# EAGLE design PSU (EAGLE 6.6.0)
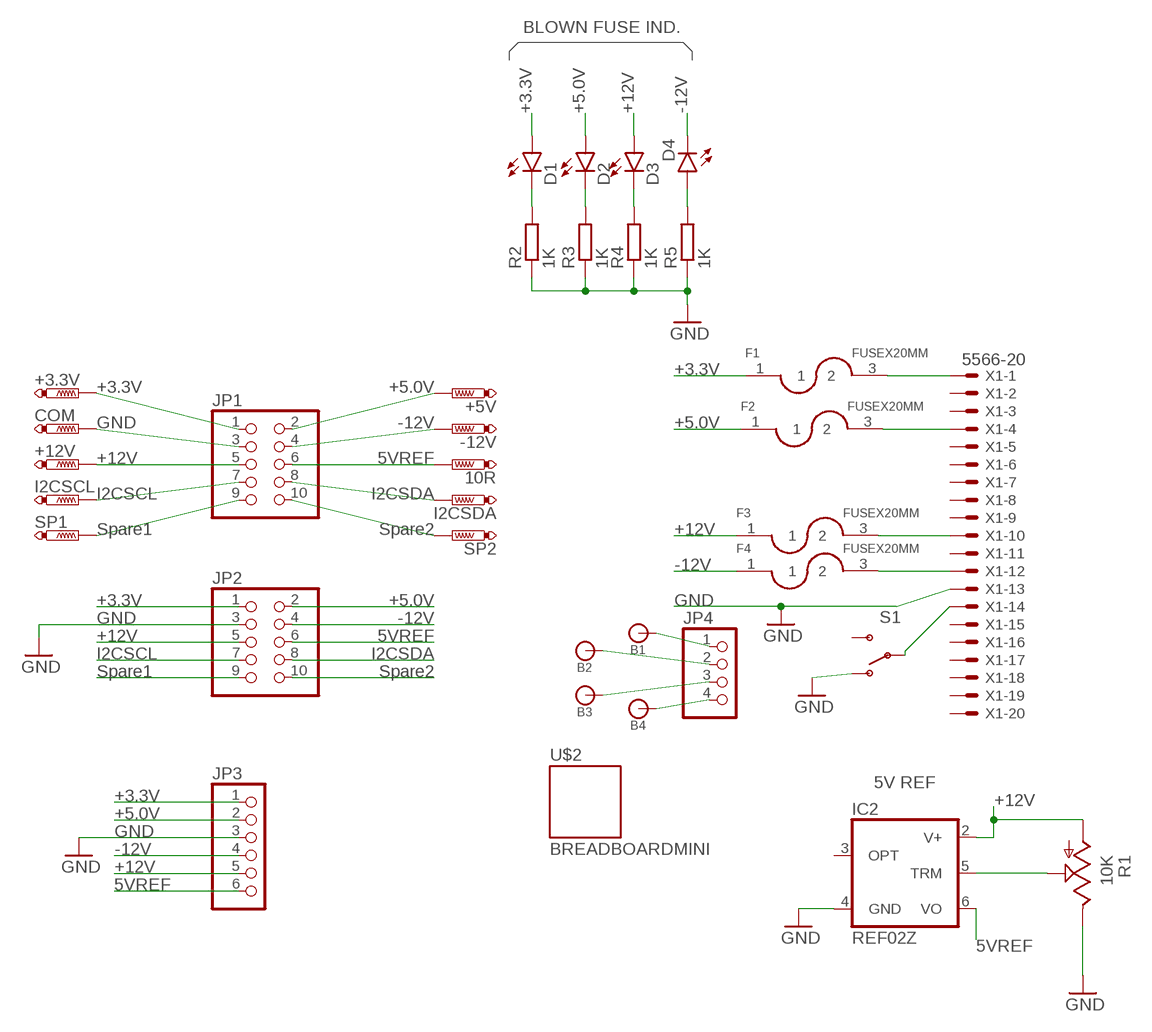
[diagram p0: schematic, sheet 1]

## Parts
10R  PTR1B1,27  [B1,27]
+3.3V  PTR1B1,27  [B1,27]
+5V  PTR1B1,27  [B1,27]
+12V  PTR1B1,27  [B1,27]
-12V  PTR1B1,27  [B1,27]
B1  BANANA_CONN  [BANANA_CONN]
B2  BANANA_CONN  [BANANA_CONN]
B3  BANANA_CONN  [BANANA_CONN]
B4  BANANA_CONN  [BANANA_CONN]
COM  PTR1B1,27  [B1,27]
D1  LED5MM  [LED5MM]
D2  LED5MM  [LED5MM]
D3  LED5MM  [LED5MM]
D4  LED5MM  [LED5MM]
F1  FUSEX20MM  [FUSE_5MM]
F2  FUSEX20MM  [FUSE_5MM]
F3  FUSEX20MM  [FUSE_5MM]
F4  FUSEX20MM  [FUSE_5MM]
I2CSCL  PTR1B1,27  [B1,27]
I2CSDA  PTR1B1,27  [B1,27]
IC2  REF02Z  [DIL08]
JP1  PINHD-2X5/90  [2X05/90]
JP2  PINHD-2X5/90  [2X05/90]
JP3  PINHD-1X6  [1X06]
JP4  PINHD-1X4  [1X04]
R1  10K  TRIM_US-PT-10  [PT-10]
R2  1K  RESISTOR-PTH-0.4  [RTH025W]
R3  1K  RESISTOR-PTH-0.4  [RTH025W]
R4  1K  RESISTOR-PTH-0.4  [RTH025W]
R5  1K  RESISTOR-PTH-0.4  [RTH025W]
S1  SWITCH-SPDTPTH  [SWITCH-SPDT]
SP1  PTR1B1,27  [B1,27]
SP2  PTR1B1,27  [B1,27]
U$2  BREADBOARDMINI  [BREADBOARD-MINI]
X1  5566-20  [5566-20]

## Nets
5VREF: 10R.TP IC2.6(VO) JP1.6 JP2.6 JP3.6
+3.3V: +3.3V.TP D1.A F1.1 JP1.1 JP2.1 JP3.1
+5.0V: +5V.TP D2.A F2.1 JP1.2 JP2.2 JP3.2
+12V: +12V.TP D3.A F3.1 IC2.2(V+) JP1.5 JP2.5 JP3.5 R1.A
-12V: -12V.TP D4.K(C) F4.1 JP1.4 JP2.4 JP3.4
B1: B1.P$1 JP4.1
B2: B2.P$1 JP4.2
B3: B3.P$1 JP4.3
B4: B4.P$1 JP4.4
GND: COM.TP IC2.4(GND) JP1.3 JP2.3 JP3.3 R1.E R2.1 R3.1 R4.1 R5.1 S1.1(O) X1.13
I2CSCL: I2CSCL.TP JP1.7 JP2.7
I2CSDA: I2CSDA.TP JP1.8 JP2.8
N$1: F2.3 X1.4
N$2: F3.3 X1.10
N$3: F4.3 X1.12
N$4: IC2.5(TRM) R1.S
N$5: F1.3 X1.1
N$6: D1.K(C) R2.2
N$7: D2.K(C) R3.2
N$8: D3.K(C) R4.2
N$9: D4.A R5.2
N$10: S1.2(P) X1.14
SPARE1: JP1.9 JP2.9 SP1.TP
SPARE2: JP1.10 JP2.10 SP2.TP
Unconnected: IC2.3(OPT) S1.3(S) X1.2 X1.3 X1.5 X1.6 X1.7 X1.8 X1.9 X1.11 X1.15 X1.16 X1.17 X1.18 X1.19 X1.20

## Notes on the sheet
- BLOWN FUSE IND.
- +3.3V | +5.0V | +12V | -12V
- +3.3V
- +3.3V | +5.0V
- GND | -12V | +5.0V
- +12V | 5VREF
- I2CSCL | I2CSDA
- Spare1 | Spare2 | +12V
- -12V
- +3.3V | +5.0V | GND
- GND | -12V
- +12V | 5VREF
- I2CSCL | I2CSDA
- Spare1 | Spare2
- 5V REF
- +3.3V | +12V
- +5.0V
- GND
- -12V
- +12V
- 5VREF
- 5VREF

## Library data of the parts
10R +3.3V +5V +12V -12V COM I2CSCL I2CSDA SP1 SP2 = testpad:PTR1: TEST PIN
B1-B4 = SparkFun-Connectors:BANANA_CONN: Through-hole banana jack
D1-D4 = SparkFun-LED:LED: LEDs Standard schematic elements and footprints for 5mm, 3mm, 1206, and 0603 sized LEDs. 5mm - Spark Fun Electronics SKU : COM-00529 (and others)
F1-F4 = SparkFun-Passives:FUSE
IC2 = linear:REF02: VOLTAGE REFERENCE
JP1 JP2 = pinhead+:PINHD-2X5: PIN HEADER
JP3 = pinhead+:PINHD-1X6: PIN HEADER
JP4 = pinhead+:PINHD-1X4: PIN HEADER
R1 = pot:TRIM_US-: POTENTIOMETER
R2-R5 = dp_devices.v6:RESISTOR
S1 = SparkFun-Electromechanical:SWITCH-SPDT: SPDT Switch Simple slide switch, Spark Fun Electronics SKU : COM-00102 DPDT SMT slide switch, AYZ0202, SWCH-08179; PROD_ID: SWCH-08261
U$2 = SparkFun-Boards:BREADBOARD: Breadboard Mini Self Adhesive This is the mechnical outline for the very small self adhesive breadboard from SparkFun Electronics. Good for very small proto areas. SKU : PRT-07916; PROD_ID: COMP-12034
X1 = con-molex:5566-20: Mini FIT connector 20 pol ATX PC-Motherboard Power connector Source: http://www.molex.com; OC_FARNELL: unknown; OC_NEWARK: unknown

## Board
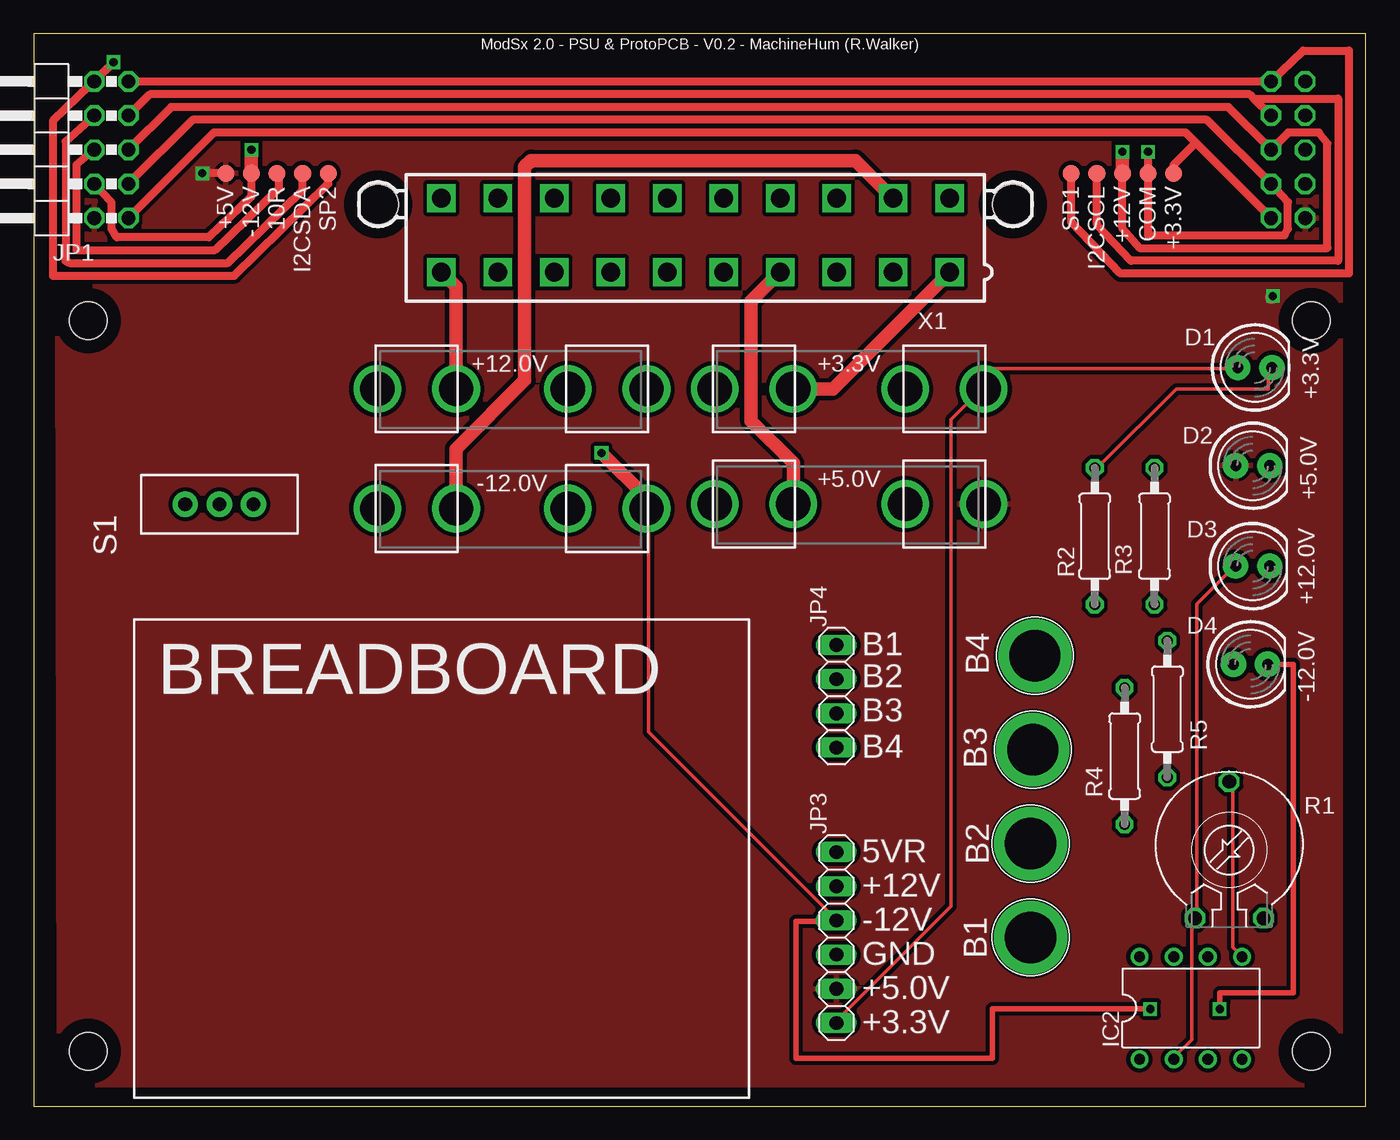
[diagram p1: board, top side]
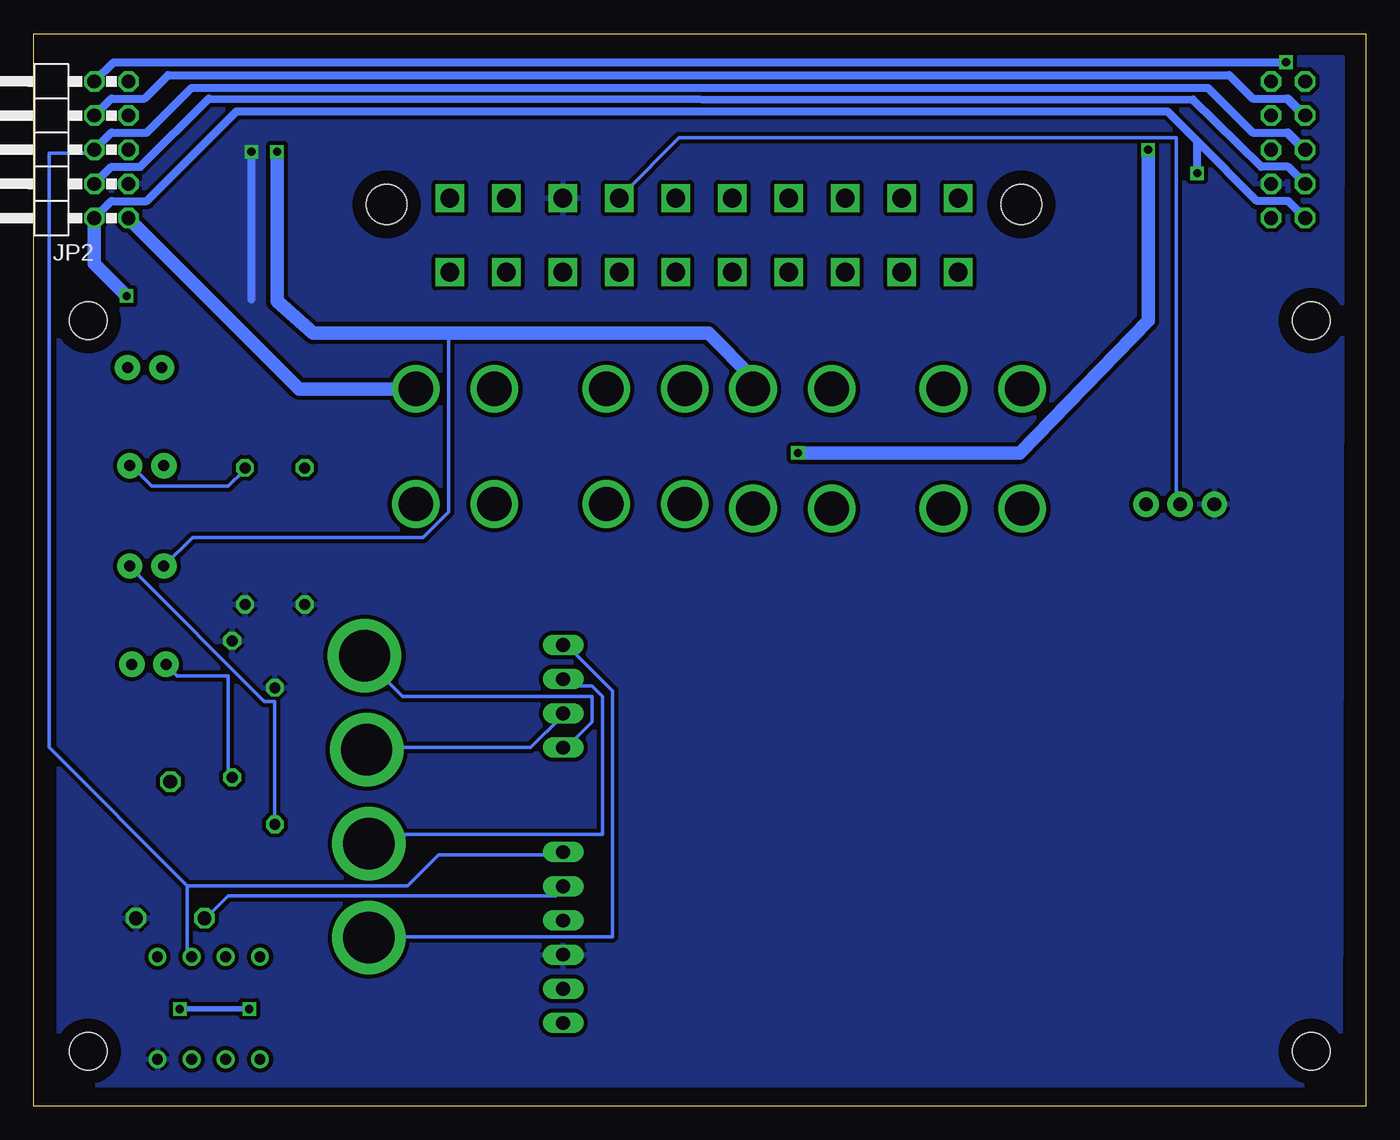
[diagram p2: board, bottom side, seen from below]

Size 99.06 x 79.76 mm. Coordinates in mm from the lower left corner, seen from the top.
Outline: 0,0 99.06,0 99.06,79.76 0,79.76 0,0
Copper layers (1*16): Top 0.035mm / dielectric 1.5mm / Bottom 0.035mm
Design rules "default": minimum track width 10mil, minimum drill 24mil, track to track 8mil, track to pad 8mil, pad to pad 8mil, via to via 8mil, smd to smd 8mil, copper to edge 40mil, drill to drill 8mil, minimum pad ring 10mil, minimum via ring 8mil, stop-mask expansion 4mil, vias tented up to drill 0mil, thermal gap 10mil
Holes 2.8 mm at 4.06,58.42 95,58.42 4.06,4.06 95,4.06

### Footprints (pad centres in the part's own frame; a part is rotated, then mirrored left to right if it is on the bottom)
B1,27 = smd 1.27 x 1.27: TP 0,0
BANANA_CONN = drill 3.81 pad 5.461: P$1 0,0
LED5MM = drill 0.813 pad 1.88: A -1.27,0; K 1.27,0
FUSE_5MM = drill 2.54 pad 3.556: 1 0,-10; 2 0,-4.158; 3 0,4.158; 4 0,10
DIL08 = drill 0.813 pad 1.27: 1 -3.81,-3.81; 2 -1.27,-3.81; 3 1.27,-3.81; 4 3.81,-3.81; 5 3.81,3.81; 6 1.27,3.81; 7 -1.27,3.81; 8 -3.81,3.81
2X05/90 = drill 1.016 octagon: 1 -5.08,-6.35; 2 -5.08,-3.81; 3 -2.54,-6.35; 4 -2.54,-3.81; 5 0,-6.35; 6 0,-3.81; 7 2.54,-6.35; 8 2.54,-3.81; 9 5.08,-6.35; 10 5.08,-3.81
1X06 = drill 1.016 long: 1 -6.35,0; 2 -3.81,0; 3 -1.27,0; 4 1.27,0; 5 3.81,0; 6 6.35,0
1X04 = drill 1.016 long: 1 -3.81,0; 2 -1.27,0; 3 1.27,0; 4 3.81,0
PT-10 = drill 1.016 octagon: A -2.54,-5.08; E 2.54,-5.08; S 0,5.08
RTH025W = drill 0.813 octagon: 1 -5.08,0; 2 5.08,0
SWITCH-SPDT = drill 1.016 pad 1.88: 1 0,2.54; 2 0,0; 3 0,-2.54
5566-20 = drill 1.4 square: 1 18.9,-2.75; 2 14.7,-2.75; 3 10.5,-2.75; 4 6.3,-2.75; 5 2.1,-2.75; 6 -2.1,-2.75; 7 -6.3,-2.75; 8 -10.5,-2.75; 9 -14.7,-2.75; 10 -18.9,-2.75; 11 18.9,2.75; 12 14.7,2.75; 13 10.5,2.75; 14 6.3,2.75; 15 2.1,2.75; 16 -2.1,2.75; 17 -6.3,2.75; 18 -10.5,2.75; 19 -14.7,2.75; 20 -18.9,2.75 | hole 3: 23.6,2.29; -23.6,2.29

### Placement (x,y rotation side)
10R  18.1,69.37 270 top
+3.3V  84.77,69.37 270 top
+5V  14.29,69.37 270 top
+12V  80.96,69.37 270 top
-12V  16.19,69.37 270 top
B1  74.14,12.54 90 top
B2  74.14,19.53 90 top
B3  74.3,26.51 90 top
B4  74.45,33.5 90 top
COM  82.87,69.37 270 top
D1  90.81,54.93 0 top
D2  90.65,47.62 0 top
D3  90.65,40.16 0 top
D4  90.49,32.86 0 top
F1  60.64,53.34 90 top
F2  60.64,44.77 90 top
F3  35.56,53.34 90 top
F4  35.56,44.45 90 top
I2CSCL  79.06,69.37 270 top
I2CSDA  20,69.37 270 top
IC2  86.04,7.3 0 top
JP1  0.7,71.12 90 top
JP2  98.36,71.12 90 bottom
JP3  59.69,12.54 90 top
JP4  59.69,30.48 270 top
R1  88.9,19.05 0 top
R2  78.9,42.39 90 top
R3  83.34,42.39 90 top
R4  81.12,26.04 270 top
R5  84.3,29.53 270 top
S1  13.81,44.77 90 top
SP1  77.15,69.37 270 top
SP2  21.91,69.37 270 top
U$2  53.18,36.2 180 top
X1  49.21,64.77 0 top

### Tracks (layer width: path | path; a pad name or v marks a point on that pad's centre or on a via)
5VREF
  Top 0.61: 10R.TP 18.26,69.22 18.26,68.26 13.49,63.66 3.17,63.66 3.17,70.01 JP1.6
  Bottom 0.254: 87.63,16.38 87.63,11.43 IC2.6 | 87.63,16.38 71.25,16.38 68.96,18.67 59.82,18.67 JP3.6 | 87.63,16.38 97.92,26.67 97.92,70.87 94.87,70.87 JP2.6
  Bottom 0.61: JP1.6 5.78,72.39 5.87,72.39 | JP2.6 93.28,72.39 90.65,72.39 87.31,75.72 11.75,75.72 8.41,72.39 5.87,72.39 | 5.87,72.39 4.6,71.12
+3.3V
  Top 0.254: JP3.1 59.82,6.48 68.2,14.86 68.2,51.05 70.48,53.34 F1.1 70.87,53.34 70.87,54.86 89.53,54.86 D1.A
  Top 0.61: JP1.1 13.4,72.39 85.66,72.39 86.41,71.64 | JP2.1 86.41,71.64 | +3.3V.TP 84.77,70.01 86.41,71.64
  Bottom 1.016: F1.1 79.31,53.34 JP2.1
+5.0V  (via drill 0.6)
  Top 0.61: +5V.TP v12.54,69.37
  Top 1.016: v92.15,60.25 92.08,60.17
  Bottom 0.61: JP1.2 5.78,67.31 8.1,67.31 12.54,71.75 | JP2.2 93.28,67.31 90.65,67.31 83.98,73.98 14.76,73.98 12.54,71.75 | v12.54,69.37 12.54,71.75
  Bottom 1.016: JP2.2 94.55,62.64 v92.15,60.25
  pour Top (isolate 0.305): 1.91,1.59 1.91,4.45 1.75,77.95 97.16,77.95 97.16,1.59
+12V  (via drill 0.6)
  Top 0.254: IC2.2 84.96,3.81 86.11,4.95 86.11,13.72 R1.A 86.49,14.1 86.49,37.34 89.15,40.01 D3.A
  Top 0.61: JP1.5 10.22,74.3 88.84,74.3 JP2.5 93.28,72.39 95.57,72.39 96.2,71.6 96.2,63.82 82.23,63.82 80.96,65.25 +12V.TP
  Top 1.016: v80.96,70.96 +12V.TP
  Bottom 0.254: JP3.5 59.82,16 60.2,15.62 84.58,15.62 86.11,14.1 R1.A | D3.A 87.25,42.29 70.1,42.29 68.2,44.2 68.2,57.47
  Bottom 1.016: F3.1 45.56,54.13 48.9,57.47 68.2,57.47 78.26,57.47 80.96,59.85 v80.96,70.96
-12V  (via drill 0.6)
  Top 0.254: JP3.4 59.44,14.1 45.72,27.81 45.72,44.2 F4.1
  Top 0.406: D4.K 93.66,32.86 93.66,8.41 88.19,8.41 v88.19,7.22 | v83.03,7.22 71.28,7.22 71.28,3.57 56.67,3.57 56.67,13.73 59.69,13.73 JP3.4
  Top 0.61: -12V.TP 16.19,67.63 13.02,64.61 6.19,64.61 5.79,65.25 5.79,67.22 JP1.4
  Top 1.016: F4.1 45.56,45.24 v42.23,48.58 | v16.19,71.12 -12V.TP
  Bottom 0.406: v88.19,7.22 v83.03,7.22
  Bottom 0.61: JP1.4 5.78,69.85 7.78,69.85 12.86,74.85 86.04,74.93 91.12,69.85 93.28,69.85 JP2.4
  Bottom 1.016: v42.23,48.58 25.72,48.58 16.19,58.42 v16.19,71.12
B1
  Bottom 0.254: JP4.1 59.44,34.29 56.01,30.86 56.01,12.57 73.91,12.57 B1.P$1
B2
  Bottom 0.254: JP4.2 59.44,31.62 59.05,31.24 57.53,31.24 56.77,30.48 56.77,20.19 73.53,20.19 73.91,19.81 B2.P$1
B3
  Bottom 0.254: JP4.3 59.82,28.96 62.1,26.67 74.3,26.67 B3.P$1
B4
  Bottom 0.254: JP4.4 59.44,26.67 57.53,28.57 57.53,30.48 71.63,30.48 74.3,33.15 B4.P$1
GND  (via drill 0.6)
  Top 0.61: JP1.3 11.81,73.34 87.25,73.34 JP2.3 93.27,67.25 93.27,65.25 93.03,64.77 82.87,64.77 COM.TP v82.87,70.96
  Bottom 0.61: v82.87,70.96 82.87,60.01
  pour Bottom (isolate 0.305): 1.91,1.59 1.75,77.95 97.16,77.95 97.16,1.59
I2CSCL
  Top 0.61: JP1.7 8.64,75.25 90.42,75.25 90.74,74.93 | JP2.7 90.74,74.93 | 90.74,74.93 97,74.93 97,62.87 81.6,62.87 79.06,65.56 I2CSCL.TP
I2CSDA
  Top 0.61: I2CSDA.TP 20,68.1 14.45,62.71 2.7,62.71 2.38,62.87 2.38,71.75 JP1.8
  Bottom 0.61: JP1.8 5.78,74.93 5.87,74.93 | JP2.8 93.28,74.93 90.81,74.93 89.06,76.68 10.16,76.68 8.41,74.93 5.87,74.93 | 5.87,74.93 4.6,73.66
N$1
  Top 1.016: F2.3 56.48,47.81 53.34,50.96 53.34,59.85 X1.4
N$2
  Top 1.016: F3.3 31.4,60.93 X1.10
N$3
  Top 1.016: F4.3 31.4,48.86 36.51,53.98 36.51,69.85 36.99,70.33 61.11,70.33 X1.12
N$4
  Top 0.254: IC2.5 89.15,11.81 89.15,24 R1.S
N$5
  Top 1.016: F1.3 59.43,53.34 X1.1
N$6
  Top 0.254: R2.2 79.25,47.62 84.96,53.34 91.82,53.34 91.82,54.86 D1.K
N$7
  Bottom 0.254: R3.2 83.44,47.24 84.58,46.1 90.3,46.1 91.82,47.62 D2.K
N$8
  Bottom 0.254: R4.2 81.15,20.95 81.15,30.1 81.92,30.1 91.82,40.01 D3.K
N$9
  Bottom 0.254: R5.2 84.58,24.77 84.58,32 88.39,32 89.15,32.77 D4.A
N$10
  Bottom 0.254: S1.2 14.1,44.96 14.1,72.01 51.05,72.01 55.24,67.82 X1.14
SPARE1
  Top 0.61: JP1.9 JP2.9 94.39,78.5 97.79,78.5 97.79,61.91 80.8,61.91 77.15,65.72 SP1.TP
SPARE2  (via drill 0.6)
  Top 0.61: SP2.TP 21.91,68.58 14.92,61.75 1.43,61.75 1.43,73.28 v5.94,77.63 JP1.10
  Bottom 0.61: JP2.10 93.12,77.63 v5.94,77.63

### Text on the board
tPlace: ModSx 2.0 - PSU & ProtoPCB - V0.2 - MachineHum (R.Walker) | +12.0V | +3.3V | +3.3V | +5.0V | +5.0V | -12.0V | +12.0V | -12.0V | BREADBOARD
tNames: B4 | B1 | B2 | B3 | B3 | B4 | B2 | 5VR | +12V | -12V | B1 | GND | +5.0V | +3.3V